# Altium schematic sheet Fujitsu_ESPHome.SchDoc: Project Architecture
size A4; PageSetup: Record=PageOptions|CenterHorizontal=True|CenterVertical=True|PrintScale=1.07|XCorrection=1.00|YCorrection=1.00|PrintKind=1|BorderSize=5000000|LeftOffset=0|BottomOffset=0|Orientation=2|PaperLength=1000|PaperWidth=1000|Scale=100|PaperSource=7|PrintQuality=600|MediaType=1|DitherType=10|PaperKind=A3|PrintScaleMode=1; Organization: Minbiocabanon Corp.; Address2: Kiwi road; Address3: TOULOUSE; Address4: FRANCE; DocumentNumber: 1; SheetNumber: 1; SheetTotal: 5
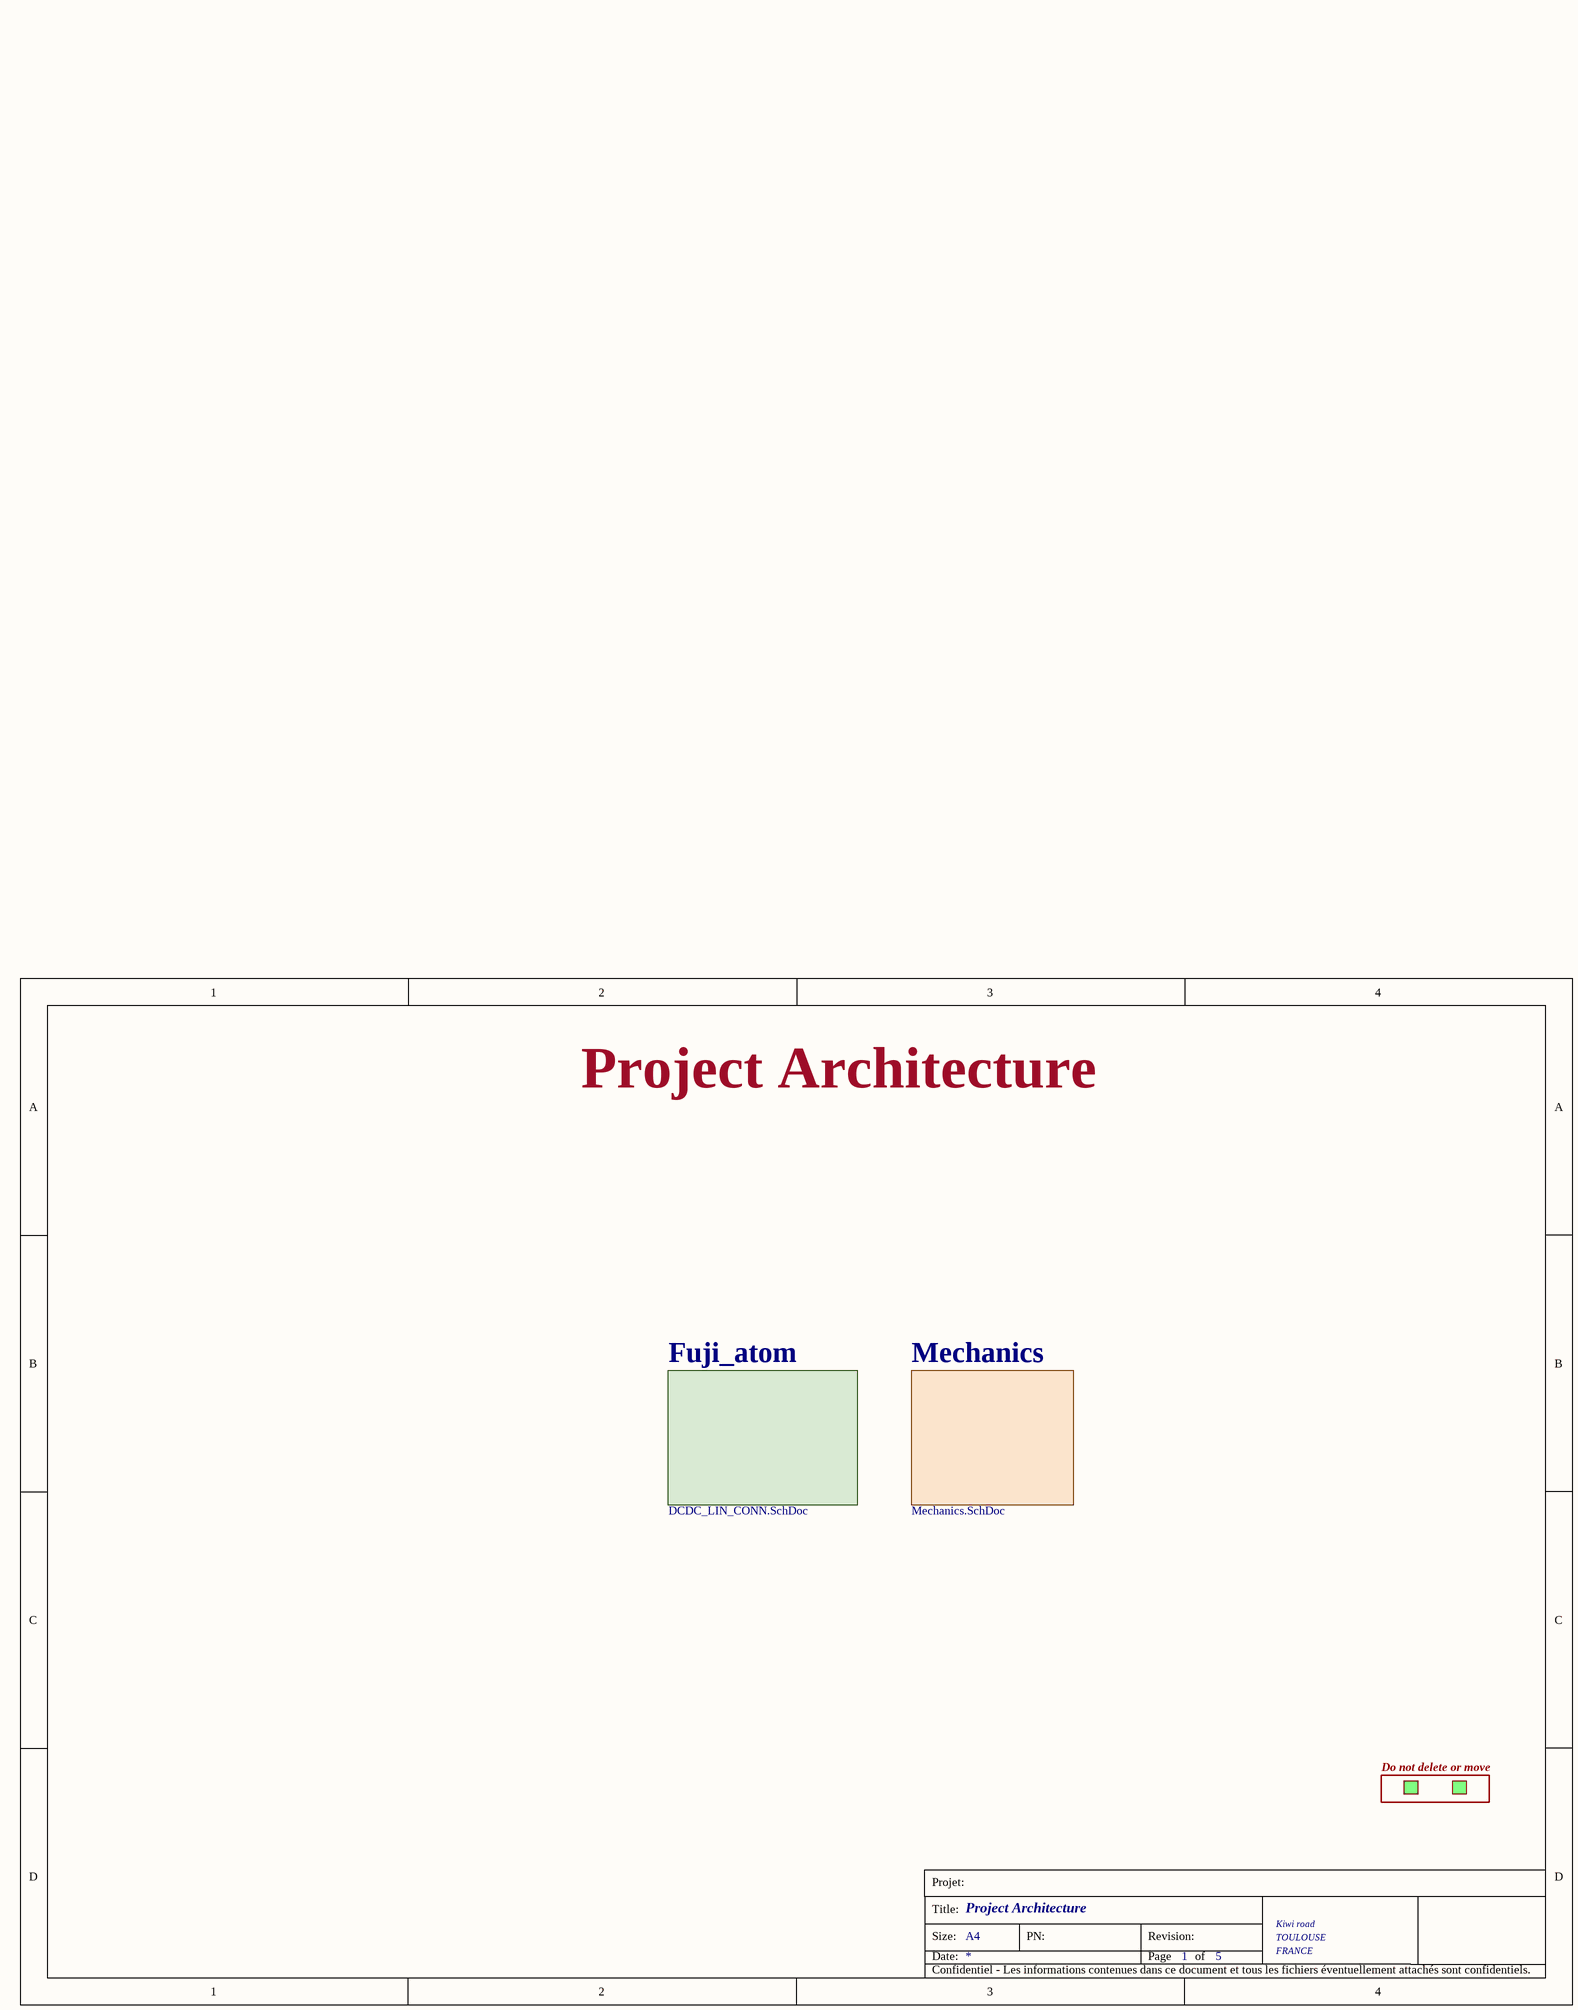
[diagram p0: Fujitsu_ESPHome.SchDoc]

## Sub-sheets
Designator = Revision History.SchDoc: no entries
Designator = COVER PAGE.SchDoc: no entries
Fuji_atom = DCDC_LIN_CONN.SchDoc: no entries
Mechanics = Mechanics.SchDoc: no entries

## Notes on the sheet
- Project Architecture
- Do not delete or move
- Projet:
- Title:
- Size:
- Date:
- A4
- PN:
- Revision:
- Page
- of
- Confidentiel - Les informations contenues dans ce document et tous les fichiers éventuellement attachés sont confidentiels.